# Altium schematic sheet STM32_Schematic.SchDoc
size A3; SheetNumber: 1; SheetTotal: 1
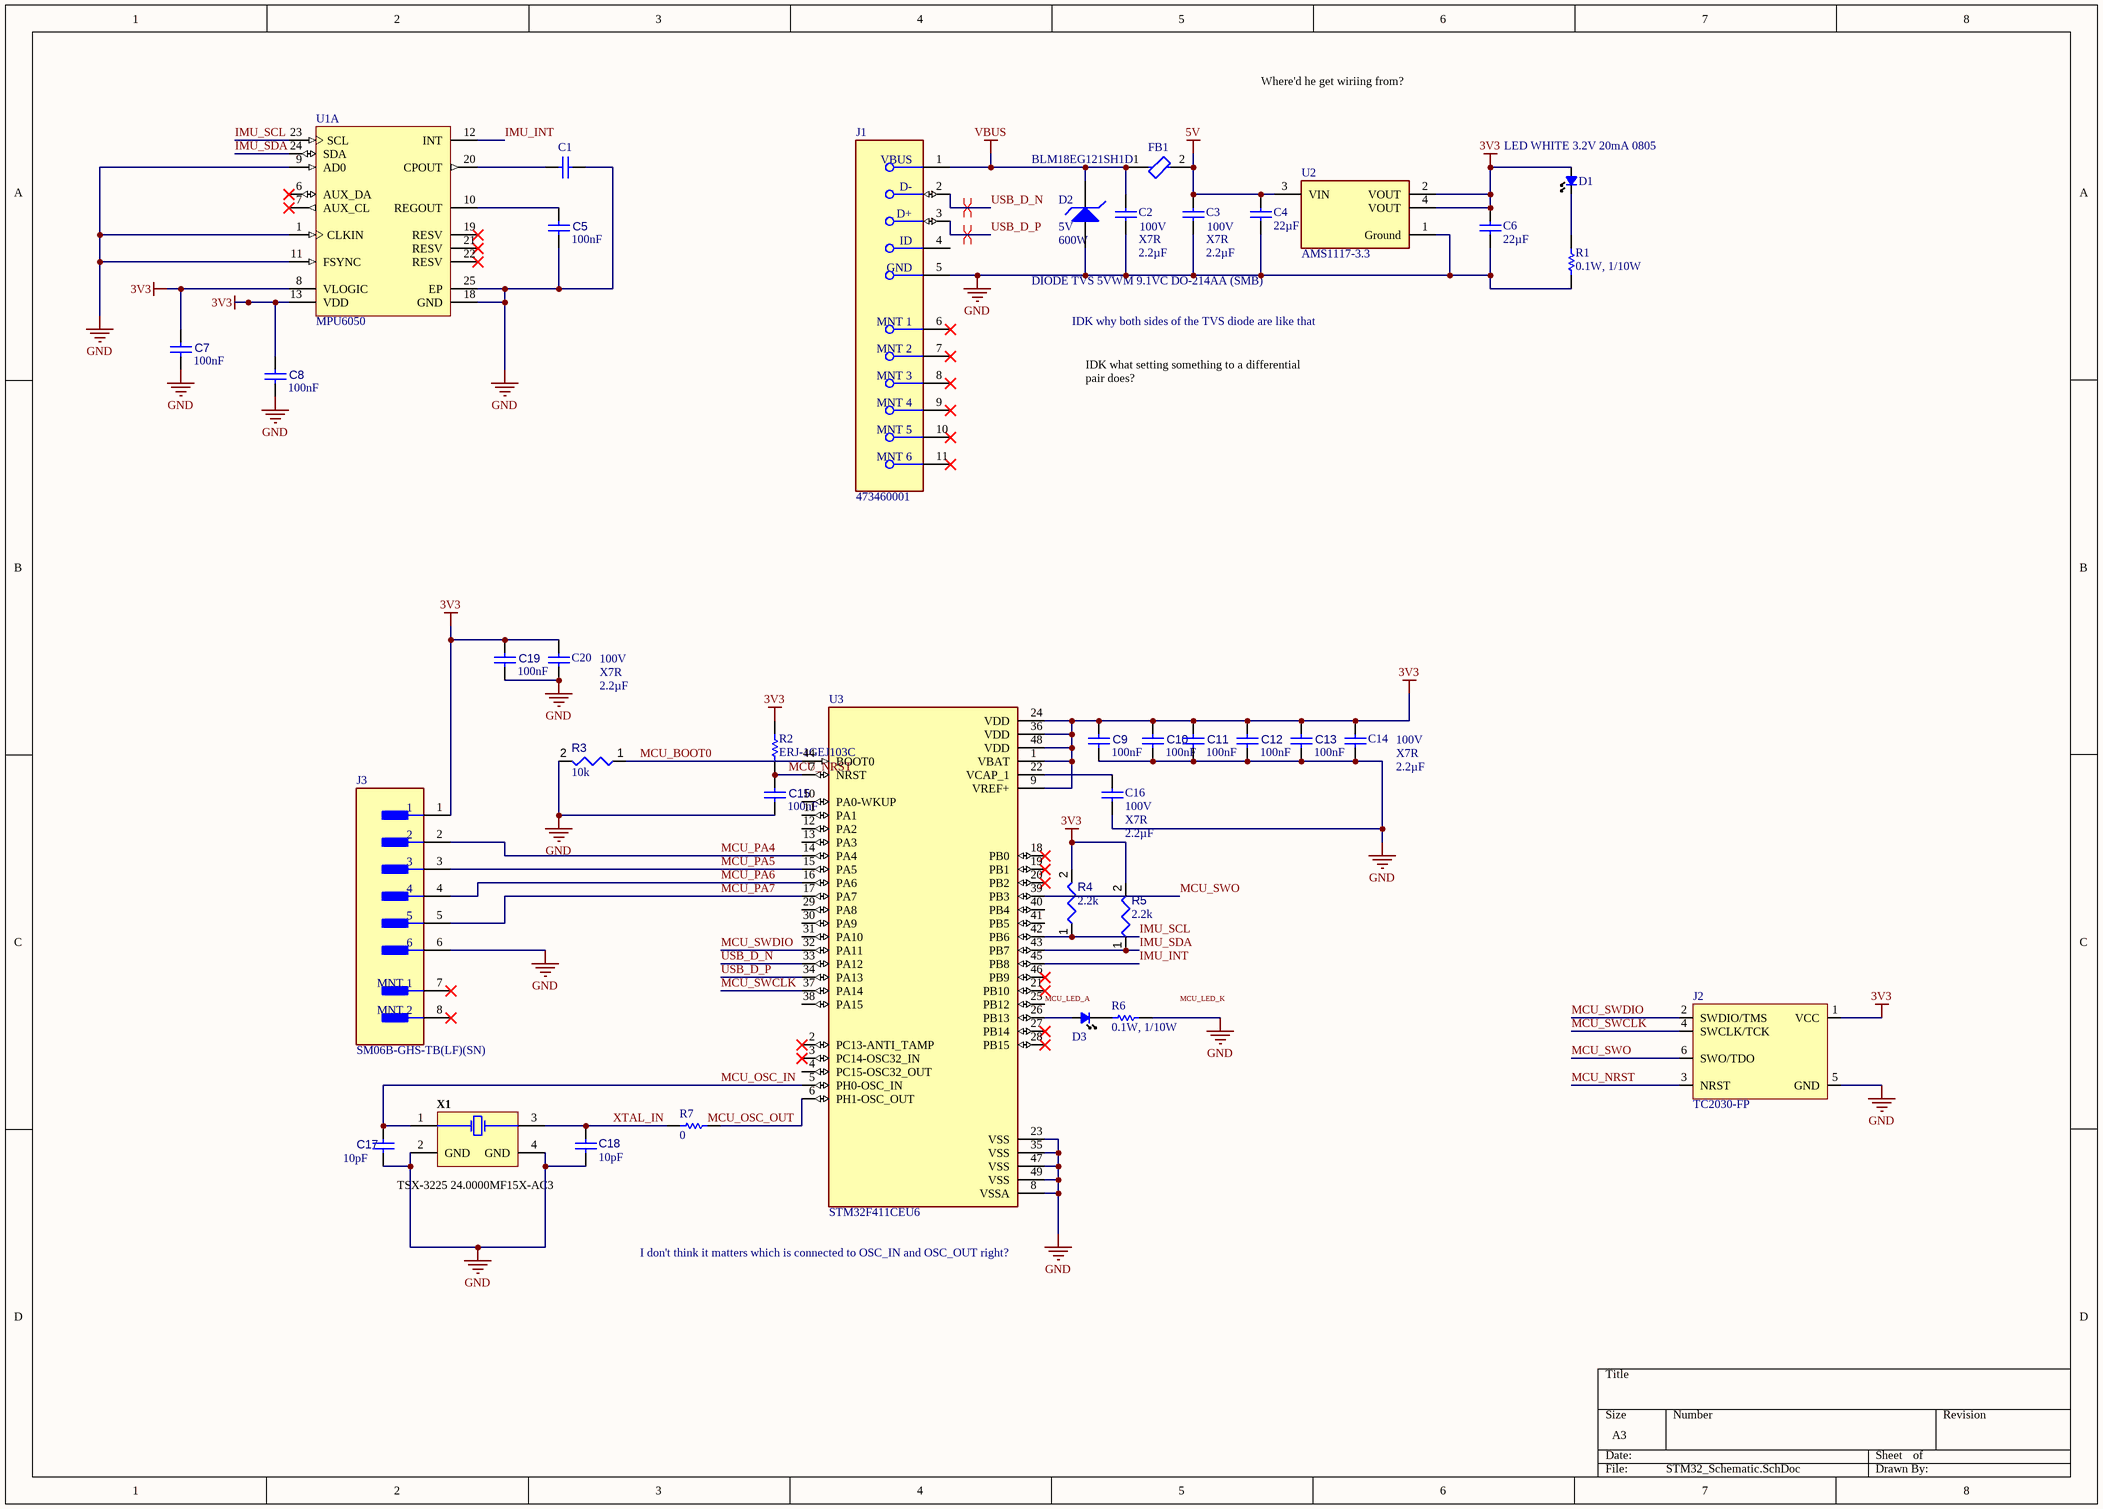
[diagram p0: STM32_Schematic.SchDoc]

## Parts
C1  CAP CER 0603 2200PF 10% X7R  [CAP, 0603]  (value not drawn)
C2  value 2.2µF  Voltage: 100V  Temperature Coefficient: X7R  [CAP, 1206]  (hidden comment: CAP CER 2.2UF 100V ±20% X7R 1206)
C3  value 2.2µF  Voltage: 100V  Temperature Coefficient: X7R  [CAP, 1206]  (hidden comment: CAP CER 2.2UF 100V ±20% X7R 1206)
C4  value 22µF  [CAP, 1210]  (hidden comment: CGA6P1X7R1C226M250AC)
C5  value 100nF  [CAPC0402(1005)60_L]  (hidden comment: Capacitor 100nF +/-20% 50V 0402)
C6  value 22µF  [CAP, 1210]  (hidden comment: CGA6P1X7R1C226M250AC)
C7  value 100nF  [CAPC0402(1005)60_L]  (hidden comment: Capacitor 100nF +/-20% 50V 0402)
C8  value 100nF  [CAPC0402(1005)60_L]  (hidden comment: Capacitor 100nF +/-20% 50V 0402)
C9  value 100nF  [CAPC0402(1005)60_L]  (hidden comment: Capacitor 100nF +/-20% 50V 0402)
C10  value 100nF  [CAPC0402(1005)60_L]  (hidden comment: Capacitor 100nF +/-20% 50V 0402)
C11  value 100nF  [CAPC0402(1005)60_L]  (hidden comment: Capacitor 100nF +/-20% 50V 0402)
C12  value 100nF  [CAPC0402(1005)60_L]  (hidden comment: Capacitor 100nF +/-20% 50V 0402)
C13  value 100nF  [CAPC0402(1005)60_L]  (hidden comment: Capacitor 100nF +/-20% 50V 0402)
C14  value 2.2µF  Voltage: 100V  Temperature Coefficient: X7R  [CAP, 1206]  (hidden comment: CAP CER 2.2UF 100V ±20% X7R 1206)
C15  value 100nF  [CAPC0402(1005)60_L]  (hidden comment: Capacitor 100nF +/-20% 50V 0402)
C16  value 2.2µF  Voltage: 100V  Temperature Coefficient: X7R  [CAP, 1206]  (hidden comment: CAP CER 2.2UF 100V ±20% X7R 1206)
C17  value 10pF  [CAPC1608X90X40ML10T20]  (hidden comment: Capacitor 10 pF +/- 5% 50 V 0603)
C18  value 10pF  [CAPC1608X90X40ML10T20]  (hidden comment: Capacitor 10 pF +/- 5% 50 V 0603)
C19  value 100nF  [CAPC0402(1005)60_L]  (hidden comment: Capacitor 100nF +/-20% 50V 0402)
C20  value 2.2µF  Voltage: 100V  Temperature Coefficient: X7R  [CAP, 1206]  (hidden comment: CAP CER 2.2UF 100V ±20% X7R 1206)
D1  LED WHITE 3.2V 20mA 0805  [LED 0805]
D2  DIODE TVS 5VWM 9.1VC DO-214AA (SMB)  Voltage - Reverse Standoff (Typ): 5V  Power - Peak Pulse: 600W  [DO-214AA Diode]
D3  (no value)  [LED 0805]
FB1  BLM18EG121SH1D  [FP-BLM18-0_15-t0_8-IPC_A]
J1  473460001  [FP-473460001-MFG]
J2  TC2030-FP  [New footprint 1]
J3  SM06B-GHS-TB(LF)(SN)  [FP-SM06B-GHS-TB_LF_SN-MFG]
R1  Power (Watts): 0.1W, 1/10W  [RES, 0603]  (hidden comment: RES 1K OHM 5% 1/10W 0603)
R2  ERJ-1GEJ103C  [RESC0603X26X15NL03T05]
R3  value 10k  [RESC0402(1005)_L]  (hidden comment: Resistor 10K  +/-1 % 0402 63 mW)
R4  value 2.2k  [RESC0402(1005)_L]  (hidden comment: Resistor 2K2  +/-5 % 0402 63 mW)
R5  value 2.2k  [RESC0402(1005)_L]  (hidden comment: Resistor 2K2  +/-5 % 0402 63 mW)
R6  Power (Watts): 0.1W, 1/10W  [RES, 0603]  (hidden comment: RES 1K OHM 5% 1/10W 0603)
R7  value 0  [RESC1005X40X25ML05T10]  (hidden comment: Resistor 0R 0402 63 mW)
U1  MPU6050  [INSE-QFN-24_V]  (part A of 2)
U2  AMS1117-3.3  [FP-AMS1117-IPC_C]
U3  STM32F411CEU6  [QFN50P700X700X60-49N]
X1  TSX-3225 24.0000MF15X-AC3  [EPSON-TSX-3225_V]

## Nets
3V3: C6.1 C7.2 C8.2 C9.2 C10.2 C11.2 C12.2 C13.2 C14.1 C19.2 C20.1 D1.2 J2.1(VCC) J3.1 R2.2 R4.2 R5.2 U1.8(VLOGIC) U1.13(VDD) U2.2(VOUT) U2.4(VOUT) U3.1(VBAT) U3.9(VREF+) U3.24(VDD) U3.36(VDD) U3.48(VDD)
5V: C3.1 C4.1 FB1.2 U2.3(VIN)
GND: C1.2 C2.2 C3.2 C4.2 C5.1 C6.2 C7.1 C8.1 C9.1 C10.1 C11.1 C12.1 C13.1 C14.2 C15.1 C16.1 C17.1 C18.1 C19.1 C20.2 D2.1 J1.5(GND) J2.5(GND) J3.6 R1.1 R3.2 R6.2 U1.1(CLKIN) U1.9(AD0) U1.11(FSYNC) U1.18(GND) U1.25(EP) U2.1(Ground) U3.8(VSSA) U3.23(VSS) U3.35(VSS) U3.47(VSS) U3.49(VSS) X1.2(GND) X1.4(GND)
VBUS: C2.1 D2.2 FB1.1 J1.1(VBUS)
IMU_INT: U1.12(INT) U3.45(PB8)
IMU_SCL: R4.1 U1.23(SCL) U3.42(PB6)
IMU_SDA: R5.1 U1.24(SDA) U3.43(PB7)
MCU_BOOT0: R3.1 U3.44(BOOT0)
MCU_LED_A: U3.25(PB12)
MCU_NRST: C15.2 J2.3(NRST) R2.1 U3.7(NRST)
MCU_OSC_IN: C17.2 U3.5(PH0-OSC_IN) X1.1(X1)
MCU_PA4: J3.2 U3.14(PA4)
MCU_PA5: J3.3 U3.15(PA5)
MCU_PA6: J3.4 U3.16(PA6)
MCU_PA7: J3.5 U3.17(PA7)
MCU_SWCLK: J2.4(SWCLK/TCK) U3.37(PA14)
MCU_SWDIO: J2.2(SWDIO/TMS) U3.32(PA11)
MCU_SWO: J2.6(SWO/TDO) U3.39(PB3)
USB_D_N: J1.2(D-) U3.33(PA12)
USB_D_P: J1.3(D+) U3.34(PA13)
XTAL_IN: C18.2 R7.1 X1.3(X2)
NetC1_1: C1.1 U1.20(CPOUT)
NetC5_2: C5.2 U1.10(REGOUT)
NetC16_2: C16.2 U3.22(VCAP_1)
NetD1_1: D1.1 R1.2
NetD3_1: D3.1 R6.1
NetD3_2: D3.2 U3.26(PB13)
NetR7_2: R7.2 U3.6(PH1-OSC_OUT)

Not connected (* = marked no-connect by the designer): J1 4(ID) 6(MNT_1)* 7(MNT_2)* 8(MNT_3)* 9(MNT_4)* 10(MNT_5)* 11(MNT_6)*; J3 7(MNT_1)* 8(MNT_2)*; U1 6(AUX_DA)* 7(AUX_CL)* 19(RESV)* 21(RESV)* 22(RESV)*; U3 2(PC13-ANTI_TAMP)* 3(PC14-OSC32_IN)* 4(PC15-OSC32_OUT) 10(PA0-WKUP) 11(PA1) 12(PA2) 13(PA3) 18(PB0)* 19(PB1)* 20(PB2)* 21(PB10)* 27(PB14)* 28(PB15)* 29(PA8) 30(PA9) 31(PA10) 38(PA15) 40(PB4) 41(PB5) 46(PB9)*

## Layout directives
differential pair: USB_D_N, USB_D_P

## Notes on the sheet
- Where'd he get wiriing from?
- IDK why both sides of the TVS diode are like that
- IDK what setting something to a differential pair does?
- I don't think it matters which is connected to OSC_IN and OSC_OUT right?
- Labels drawn without touching a wire or pin: MCU_LED_K, MCU_OSC_OUT

## Library data of the parts
C1 = CMP-001-00089-2: ±10% 50V Ceramic Capacitor X7R 0603 (1608 Metric); Manufacturer Part Number: C0603C222K5RAC7411; Dissipation Factor: 2.5%; Capacitance: 2.2nF; Width: 0.8mm; Max Operating Temperature: 125°C; Tolerance: 10%; Termination: SMD/SMT; Length: 1.6mm; Voltage Rating: 50V; Mount: Surface Mount; Case Code (Imperial): 0603; Min Operating Temperature: -55°C; Dielectric: X7R; Supplier Part Number: 399-17586-1-ND; Radiation Hardening: No; Depth: 0.8mm; Case Code (Metric): 1608; Dielectric Material: Ceramic; Height: 0.8mm; Case/Package: 0603; Lead Pitch: 0.7mm; Voltage Rating (DC): 50V
C2 C3 C14 C16 C20 = CMP-013-0032-2: 2.2µF ±20% 100V Ceramic Capacitor X7R 1206 (3216 Metric); Manufacturer 1: TDK Corporation; Manufacturer Part Number 1: CGA5L3X7S2A225M160AB; Part Status: Active; Operating Temperature: -55°C ~ 125°C; Lead Style: -; Lead Spacing: -; Mounting Type: Surface Mount, MLCC; Ratings: -; Package / Case: 1206 (3216 Metric); Tolerance: 20%; Packaging: Cut Tape (CT); Supplier Part Number 1: 445-12947-1-ND; ComponentLink1URL: http://www.murata.com/~/media/webrenewal/support/library/catalog/products/capacitor/mlcc/c02e.ashx; Design Item ID: CAP CER 2.2UF 100V ±20% X7R 1206; Thickness (Max): 0.071" (1.80mm); ComponentLink1Description: http://www.murata.com/~/media/webrenewal/support/library/catalog/products/capacitor/mlcc/c02e.ashx; Supplier 1: Digi-key; Source: Schematic Diagrams.SchLib; Size / Dimension: 0.126" L x 0.063" W (3.20mm x 1.60mm); Height - Seated (Max): -
C4 C6 = CMP-001-00094-1: CAP CER 22UF 16V X7R 1210; Capacitor Type: Ceramic; Max Operating Temperature: 125°C; Min Operating Temperature: -55°C; Pins: 2; Case/Package: 1210; Voltage Rating: 16V; RoHS Compliant: Yes
C5 C7-C13 C15 C19 = CMP-001-00067-3: Chip Capacitor, 100nF +/-20%, 50V, 0402, Thickness 0.6 mm; Tolerance: 10%; Mounting Technology: SMT; Voltage Rating: 50V; Max Operating Temperature: 85°C; Case/Package: 0402; Min Operating Temperature: -55°C; Pins: 2
C17 C18 = CMP-001-00014-5: Chip Capacitor, 10 pF, +/- 5%, 50 V, 0603 (1608 Metric); Voltage Rating: 50V; Capacitor Type: Ceramic; Case/Package: 0603; Mounting Technology: SM; Pins: 2; Max Operating Temperature: 125°C; Tolerance: 5%; Min Operating Temperature: -55°C; RoHS Compliant: True
D1 = CMP-004-00053-1: 2.0(L)X1.3(W)X0.8(H) Mm White Le; Manufacturer: Inolux; Manufacturer Part Number: B1701TW--20P000314U1930; RoHS: No; Design Item ID: LED WHITE 3.2V 20mA 0805; Source: Local.SchLib
D2 = CMP-014-0015-1: TVS DIODE 5V 9.1V DO214AA; Manufacturer: Vishay Semiconductor Diodes Division; Manufacturer Part Number: SMBJ5.0D-M3/H; Current - Peak Pulse (10/1000µs): 65.9A; Power Line Protection: No; Voltage - Breakdown (Min): 6.5V; Operating Temperature: -55°C ~ 150°C (TJ); Supplier Device Package: DO-214AA (SMBJ); Mounting Type: Surface Mount; Package / Case: DO-214AA, SMB; ComponentLink1Description: http://www.vishay.com/docs/87606/87606.pdf; Applications: General Purpose; Stock 1: 6900; Packaging: Cut Tape (CT); Pricing 1: 1=0.51, 10=0.416, 25=0.3808, 100=0.2833, 250=0.25668 (CAD); Source: Schematic Diagrams.SchLib; Capacitance @ Frequency: -; Voltage - Clamping (Max) @ Ipp: 9.1V; Part Status: Active; ComponentLink1URL: http://www.vishay.com/docs/87606/87606.pdf; RoHS: RoHS Compliant; Design Item ID: DIODE TVS 5VWM 9.1VC DO-214AA (SMB)
D3 = CMP-004-00053-1: 2.0(L)X1.3(W)X0.8(H) Mm White LeLED WHITE 3.2V 20mA 0805; Manufacturer: Inolux; Manufacturer Part Number: B1701TW--20P000314U1930; RoHS: No; Design Item ID: LED WHITE 3.2V 20mA 0805; Source: Local.SchLib
FB1 = CMP-06046-002473-1: Chip Ferrite Bead, 0603, 120Ω @ 100MHz, 0.04Ω, 25%, 2A; Number of Circuits: 1; Impedance: 120R; DC Resistance (DCR): 40mR; Weight: 7.1E-05oz; Tolerance: 25%; Height: 0.8mm; Packaging: Tape and Reel; Case/Package: 0603; Termination: SMD/SMT; Depth: 0.95mm; Length: 1.6mm; RoHS Compliant: Yes; Max DC Current: 2A; Package Quantity: 4000; Test Frequency: 100MHz; Series: BLM; Width: 0.8mm; Max Operating Temperature: 125°C; Min Operating Temperature: -55°C
J1 = CMP-2000-05246-2: CONN RCPT USB2.0 MICRO B SMD R/A; Manufacturer: Molex; Conn Orientation: Right Angle; Is Female: yes; Shielding: true; Pitch: 0.65mm; Number Of Contacts: 5; Voltage Rating: 30V; Current Rating: 1.8A; Device Class L2: USB Connectors; Digikey Description: CONN RCPT USB2.0 MICRO B SMD R/A; Height: 2.945mm; RoHS: TRUE; ComponentLink2Description: Datasheet; Octopart: https://octopart.com/47346-0001-molex-7164928; Automotive: No; Package: 0; Category: Conn; Device Class L1: Connectors; Usb Standard: USB 2.0; Temperature: -30°C to +85°C; Temperature Range Low: -30°C; Footprint Url: https://www.molex.com/pdm_docs/sd/473460001_sd.pdf; ComponentLink2URL: https://www.molex.com/webdocs/datasheets/pdf/en-us/0473460001_IO_CONNECTORS.pdf; Lead Free: Yes; Manufacturer Part Number: 473460001; Contact Material: Gold,Nickel; Temperature Range High: +85°C; Device Class L3: unset
J2 = CMP-002-00275-1
J3 = CMP-17439-000061-1: CONN HEADER SMD R/A 6POS 1.25MM; Number of Contacts: 6; Voltage Rating: 50V; Current Rating: 1A; Connector Type: Outer Shroud Contact; Contact Resistance: 50mR; Orientation: Right Angle; Max Operating Temperature: 85°C; Mount: Surface Mount; Packaging: Tape and Reel; Contact Plating: Tin; Depth: 4.05mm; Max Voltage Rating (AC): 50V; Lead Free: Lead Free; Pitch: 1.25mm; Number of Positions: 6; Max Current Rating: 1A; Termination: Solder; Min Operating Temperature: -25°C; Housing Color: Beige; Fastening Type: Ramp; Length: 10.75mm; Color: Natural; Contact Material: Bronze; Housing Material: Polyamide; Number of Rows: 1
R1 R6 = CMP-010-0054-2: 1k Ohm ±5% 0.1W, 1/10W Chip Resistor 0603 (1608 Metric); Manufacturer Part Number 1: RC0603JR-071KL; Manufacturer 1: Yageo; Temperature Coefficient: ±100ppm/°C; Composition: Thick Film; Design Item ID: RES 1K OHM 5% 1/10W 0603; Pricing 1: 1=0.15, 10=0.017, 100=0.0071, 1000=0.0032, 2500=0.00278 (CAD); Source: Schematic Diagrams.SchLib; Part Status: Active; Operating Temperature: -55°C ~ 155°C; Height - Seated (Max): 0.022" (0.55mm); Features: Moisture Resistant; Supplier Part Number 1: 311-1.0KGRCT-ND; Tolerance: 5%; Size / Dimension: 0.063" L x 0.031" W (1.60mm x 0.80mm); Resistance (Ohms): 1k; Failure Rate: -; ComponentLink1Description: http://www.yageo.com/documents/recent/PYu-RC_Group_51_RoHS_L_7.pdf; RoHS: RoHS Compliant; Package / Case: 0603 (1608 Metric); Stock 1: 4415240; ComponentLink1URL: http://www.yageo.com/documents/recent/PYu-RC_Group_51_RoHS_L_7.pdf; Supplier 1: Digi-Key; Packaging: Cut Tape (CT); Supplier Device Package: 0603
R2 = CMP-2004-03146-1: Manufacturer: Panasonic; Part Number: ERJ-1GEJ103C
R3 = CMP-009-00149-2: Chip Resistor, 10 kOhms, +/-1 %, 63 mW, -55 to 125 degC, 0402; Power: 63mW; Tolerance: 1%; Pins: 2; Max Operating Temperature: 155°C; Min Operating Temperature: -55°C; Case/Package: 0402
R4 R5 = CMP-009-00166-2: Chip Resistor, 2,2 kOhms, +/-5 %, 63 mW, -55 to 155 degC, 0402; Power: 63mW; Tolerance: 5%; Min Operating Temperature: -55°C; Case/Package: 0402; Pins: 2; Max Operating Temperature: 155°C
R7 = CMP-009-00004-4: Chip Resistor, 0 Ohm, 0.063 W, -55 to 155 degC, 0402 (1005 Metric); Power: 63mW; Voltage Rating: 50V; Case/Package: 0402; Pins: 2; Mounting Technology: SM; Min Operating Temperature: -55°C; Max Operating Temperature: 155°C; RoHS Compliant: True
U1 = CMP-010-00014-2: 3-Axis Gyroscope, 3-Axis Accelerometer, 2.375 to 3.46 V, -40 to 105 degC, 24-Pin QFN, RoHS, Tape and Reel; Manufacturer: InvenSense; Interface: I2C; Max Supply Voltage: 3.6V; Sensor Type: Motion; Min Supply Voltage: 2.5V; Max Operating Temperature: 85°C; Package Quantity: 5000; Mounting Technology: SM; Datasheet Version: Rev. 3.4, 08/2013; Package Reference: QFN-24; Case/Package: QFN; Datasheet URL: https://datasheet.ciiva.com/1513/1788002-1513632.pdf; RoHS Compliant: True; Packaging: CutTape; Pins: 24; Package Description: 24-Pin Quad Flat No-lead Package, Body 4 x 4 mm, Pitch 0.5 mm; Min Operating Temperature: -40°C
U2 = CMP-209535-000001-1: LDO Voltage Regulators 1A, 3.3V; Manufacturer: Advanced Monolithic Systems; Dropout Voltage: 1.1V; Output Type: Fixed; Nominal Supply Current: 5mA; Max Power Dissipation: 1.2W; Max Supply Voltage: 15V; Number Of Outputs: 1; Standoff Height: 0.64mm; Max Junction Temp: +125°C; Height: 1.8mm; Package: AMS1117; Device Class L2: Power Management ICs; ComponentLink2Description: Datasheet; ComponentLink2URL: http://www.advanced-monolithic.com/pdf/ds1117.pdf; Category: IC; RoHS: TRUE; Automotive: No; Device Class L1: Integrated Circuits (ICs); Output Current: 1A; Device Class L3: Voltage Regulators - Linear; Temperature: -40°C to +125°C; Output Voltage: 3.3V; Manufacturer Part Number: AMS1117-3.3; Temperature Range Low: -40°C; Octopart: https://octopart.com/ams1117-3.3-advanced+monolithic+systems-25899300; Lead Free: Yes; Ipc Land Pattern Name: SOT229P700X180-4; Temperature Range High: +125°C
U3 = CMP-031-00043-1: High-performance access line, ARM Cortex-M4 core with DSP and FPU, 512 Kbytes Flash, 100 MHz CPU, ART Accelerator; Pins: 49; Component Type: Standard; MP: STM32F411CEU6; Availability: Unavailable; Value: *; Case/Package: None; Source: STM32F411CEU6.SchLib; Design Item ID: STM32F411CEU6; Price: None
X1 = CMP-2000-07333-1: MHz Range Crystal, 24 MHz, -40 to 85 degC, 4-Pin SMD, RoHS, Tape and Reel; Manufacturer: Epson; Brand: EpsonTiming; Frequency Stability: 10PPM; Frequency: 24MHz; ESR: 40Ohms; Load Capacitance: 9pF; Unit Weight: 0.000564oz; Drive Level: 200uW; Datasheet Version: 12/2015; RoHS: True; Operating Temperature Range: -40Cto+85C; Length: 3.2mm; Tolerance: 10PPM; Width: 2.5mm; Mounting Technology: SurfaceMount; Package Description: 4-Pin Surface Mount Device, Body 3.2 x 2.5 mm; Manufacturer URL: https://www.eea.epson.com/; Factory Pack Quantity: 250; Package Reference: TSX-3225; Height: 0.6mm; Mounting Style: SMD/SMT; Termination Style: SMD/SMT; Datasheet URL: https://support.epson.biz/td/api/doc_check.php?dl=brief_FA-238V_en.pdf; Type: Crystal; Series: TSX-3225; Package / Case: 3.2mmx2.5mm; Product Category: Crystals; Packaging: Reel